# Altium schematic sheet Part C.SchDoc
size A4; SheetNumber: 10; SheetTotal: 16
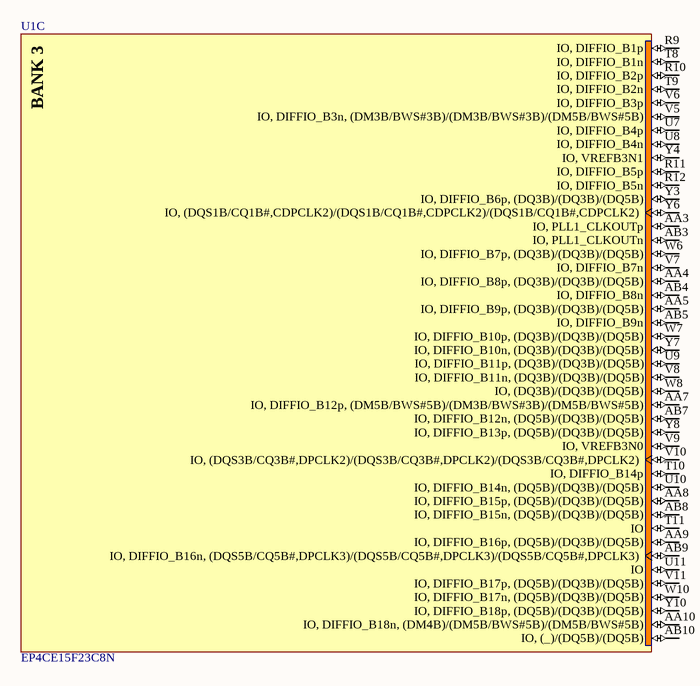
[diagram p0: Part C.SchDoc]

## Parts
U1  EP4CE15F23C8N  [FBGA484_A-240]  (part C of 13)

## Nets

Not connected (* = marked no-connect by the designer): U1 AA3(IO,_PLL1_CLKOUTp) AA4(IO,_DIFFIO_B8p,_(DQ3B)/(DQ3B)/(DQ5B)) AA5(IO,_DIFFIO_B9p,_(DQ3B)/(DQ3B)/(DQ5B)) AA7(IO,_DIFFIO_B12p,_(DM5B/BWS#5B)/(DM3B/BWS#3B)/(DM5B/BWS#5B)) AA8(IO,_DIFFIO_B15p,_(DQ5B)/(DQ3B)/(DQ5B)) AA9(IO,_DIFFIO_B16p,_(DQ5B)/(DQ3B)/(DQ5B)) AA10(IO,_DIFFIO_B18n,_(DM4B)/(DM5B/BWS#5B)/(DM5B/BWS#5B)) AB3(IO,_PLL1_CLKOUTn) AB4(IO,_DIFFIO_B8n) AB5(IO,_DIFFIO_B9n) AB7(IO,_DIFFIO_B12n,_(DQ5B)/(DQ3B)/(DQ5B)) AB8(IO,_DIFFIO_B15n,_(DQ5B)/(DQ3B)/(DQ5B)) AB9(IO,_DIFFIO_B16n,_(DQS5B/CQ5B#,DPCLK3)/(DQS5B/CQ5B#,DPCLK3)/(DQS5B/CQ5B#,DPCLK3)) AB10(IO,_(_)/(DQ5B)/(DQ5B)) R9(IO,_DIFFIO_B1p) R10(IO,_DIFFIO_B2p) R11(IO,_DIFFIO_B5p) R12(IO,_DIFFIO_B5n) T8(IO,_DIFFIO_B1n) T9(IO,_DIFFIO_B2n) T10(IO,_DIFFIO_B14p) T11(IO) U7(IO,_DIFFIO_B4p) U8(IO,_DIFFIO_B4n) U9(IO,_DIFFIO_B11p,_(DQ3B)/(DQ3B)/(DQ5B)) U10(IO,_DIFFIO_B14n,_(DQ5B)/(DQ3B)/(DQ5B)) U11(IO) V5(IO,_DIFFIO_B3n,_(DM3B/BWS#3B)/(DM3B/BWS#3B)/(DM5B/BWS#5B)) V6(IO,_DIFFIO_B3p) V7(IO,_DIFFIO_B7n) V8(IO,_DIFFIO_B11n,_(DQ3B)/(DQ3B)/(DQ5B)) V9(IO,_VREFB3N0) V10(IO,_(DQS3B/CQ3B#,DPCLK2)/(DQS3B/CQ3B#,DPCLK2)/(DQS3B/CQ3B#,DPCLK2)) V11(IO,_DIFFIO_B17p,_(DQ5B)/(DQ3B)/(DQ5B)) W6(IO,_DIFFIO_B7p,_(DQ3B)/(DQ3B)/(DQ5B)) W7(IO,_DIFFIO_B10p,_(DQ3B)/(DQ3B)/(DQ5B)) W8(IO,_(DQ3B)/(DQ3B)/(DQ5B)) W10(IO,_DIFFIO_B17n,_(DQ5B)/(DQ3B)/(DQ5B)) Y3(IO,_DIFFIO_B6p,_(DQ3B)/(DQ3B)/(DQ5B)) Y4(IO,_VREFB3N1) Y6(IO,_(DQS1B/CQ1B#,CDPCLK2)/(DQS1B/CQ1B#,CDPCLK2)/(DQS1B/CQ1B#,CDPCLK2)) Y7(IO,_DIFFIO_B10n,_(DQ3B)/(DQ3B)/(DQ5B)) Y8(IO,_DIFFIO_B13p,_(DQ5B)/(DQ3B)/(DQ5B)) Y10(IO,_DIFFIO_B18p,_(DQ5B)/(DQ3B)/(DQ5B))

## Notes on the sheet
- (in symbol FPGA_EP4CE15F23C8N, part C) BANK 3

## Library data of the parts
U1 = FPGA_EP4CE15F23C8N: Cyclone IV Family FPGA, 1.2V Core, 343 I/O Pins, 4 PLLs, 484-Pin FBGA, Speed Grade 8, Commercial Grade, Pb-Free; Manufacturer: Altera; PackageVersion: ver1.0, Jun-2011; PackageReference: FBGA484_A-240; ComponentLink3URL: http://www.altera.com/literature/lit-dp.jsp?category=cyc%204&showspreadsheet=y; ComponentLink1Description: Manufacturer URL; DatasheetVersion: ver1.6, Nov-2011; ComponentLink3Description: Pinout; ComponentLink2URL: http://www.altera.com/literature/hb/cyclone-iv/cyclone4-handbook.pdf; ComponentLink1URL: http://www.altera.com/; ComponentLink2Description: Handbook; PackageDescription: 484-Pin FineLine Ball Grid Array (FBGA) - Wire Bond - A:2.40; Code_JEDEC: MS-034-AAJ-1; ComponentLink4URL: http://www.altera.com/devicepackaging/04R00247-02.pdf; ComponentLink4Description: Package Specification